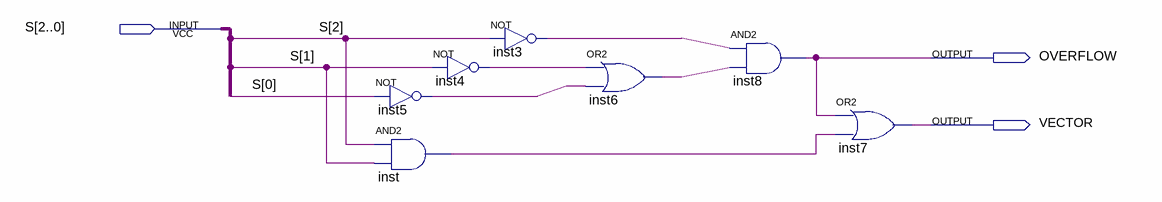
[diagram p0: schematic sheet]
// Quartus schematic special_selector.bdf as structural Verilog: 7 symbols, 3 pins
module special_selector (
  input  [2:0] S,
  output OVERFLOW,
  output VECTOR
);

  wire inst3_out, inst4_out, inst5_out, inst6_out, inst_out;

  not inst5 (inst5_out, S[0]);
  and inst (inst_out, S[2], S[1]);
  not inst4 (inst4_out, S[1]);
  not inst3 (inst3_out, S[2]);
  or inst6 (inst6_out, inst4_out, inst5_out);
  and inst8 (OVERFLOW, inst3_out, inst6_out);
  or inst7 (VECTOR, OVERFLOW, inst_out);
endmodule
